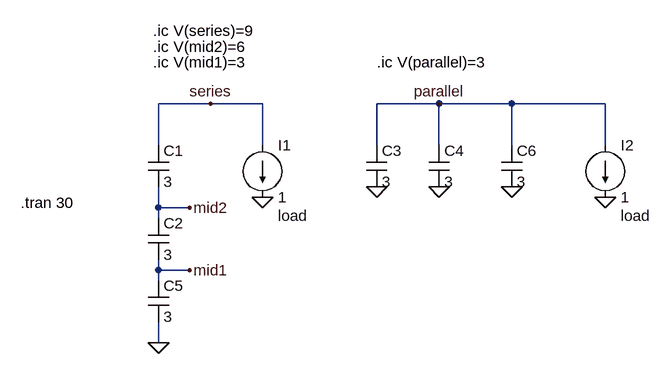
[diagram p0: schematic Series_vs_Parallel_SuperCaps.asc]
Series_vs_Parallel_SuperCaps.asc, the LTspice schematic file:
Version 4
SHEET 1 880 680
WIRE 144 32 64 32
WIRE 224 32 144 32
WIRE 496 32 400 32
WIRE 608 32 496 32
WIRE 752 32 608 32
WIRE 64 96 64 32
WIRE 224 96 224 32
WIRE 400 96 400 32
WIRE 496 96 496 32
WIRE 608 96 608 32
WIRE 752 96 752 32
WIRE 64 192 64 160
WIRE 112 192 64 192
WIRE 64 208 64 192
WIRE 64 288 64 272
WIRE 112 288 64 288
WIRE 64 304 64 288
WIRE 64 400 64 368
FLAG 400 160 0
FLAG 496 160 0
FLAG 64 400 0
FLAG 224 176 0
FLAG 752 176 0
FLAG 144 32 series
FLAG 496 32 parallel
FLAG 112 192 mid2
FLAG 112 288 mid1
FLAG 608 160 0
SYMBOL cap 48 96 R0
SYMATTR InstName C1
SYMATTR Value 3
SYMBOL cap 48 208 R0
SYMATTR InstName C2
SYMATTR Value 3
SYMBOL cap 384 96 R0
SYMATTR InstName C3
SYMATTR Value 3
SYMBOL cap 480 96 R0
SYMATTR InstName C4
SYMATTR Value 3
SYMBOL current 224 96 R0
WINDOW 123 0 0 Left 0
WINDOW 39 24 108 Left 2
SYMATTR InstName I1
SYMATTR Value 1
SYMATTR SpiceLine load
SYMBOL current 752 96 R0
WINDOW 123 0 0 Left 0
WINDOW 39 24 108 Left 2
SYMATTR InstName I2
SYMATTR Value 1
SYMATTR SpiceLine load
SYMBOL cap 48 304 R0
SYMATTR InstName C5
SYMATTR Value 3
SYMBOL cap 592 96 R0
SYMATTR InstName C6
SYMATTR Value 3
TEXT 56 -80 Left 2 !.ic V(series)=9
TEXT 400 -32 Left 2 !.ic V(parallel)=3
TEXT -148 184 Left 2 !.tran 30
TEXT 56 -56 Left 2 !.ic V(mid2)=6
TEXT 56 -32 Left 2 !.ic V(mid1)=3

The netlist it stands for:
* Series_vs_Parallel_SuperCaps.asc
C1 series mid2 3
C2 mid2 mid1 3
C3 parallel 0 3
C4 parallel 0 3
I1 series 0 1 load
I2 parallel 0 1 load
C5 mid1 0 3
C6 parallel 0 3
.ic V(series)=9
.ic V(parallel)=3
.tran 30
.ic V(mid2)=6
.ic V(mid1)=3
.backanno
.end